# Altium project PCB_Project1.PrjPCB
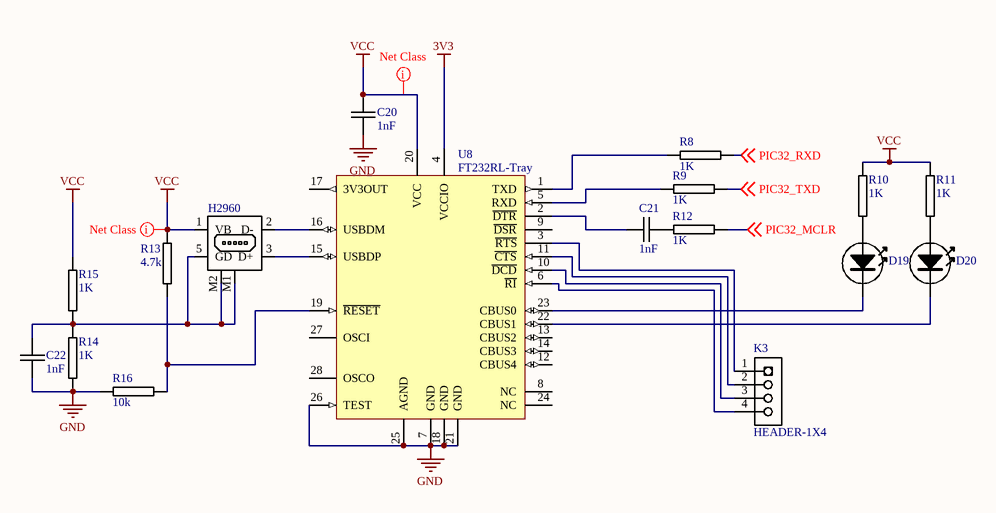
[diagram p0: USB_UART.SchDoc]
5 sheets, 78 parts. Net scope: global (net labels, ports and power ports of the same name join across sheets).
Board file: PCB1.PcbDoc
Sheets:
  USB_UART.SchDoc
  PowerSupply.SchDoc
  PIC32.SchDoc
  LED Driver.SchDoc
  CanTransceiver.SchDoc

## Sheet USB_UART.SchDoc: USB to UART interface
size A; Author: Ben Smith; CompanyName: CSUS FSAE - CPE187; DocumentName: USB to UART interface

### Parts
C20  1nF  [0603C-GENERIC]
C21  1nF  [0603C-GENERIC]
C22  1nF  [0603C-GENERIC]
D19  TOPLED-RED  [TOPLED-RED]  (value not drawn)
D20  TOPLED-RED  [TOPLED-RED]  (value not drawn)
K1  H2960  [usb-mini-b]
K3  HEADER-1X4  [HEADER-1X4]
R8  1K  [0603R-1k]
R9  1K  [0603R-1k]
R10  1K  [0603R-1k]
R11  1K  [0603R-1k]
R12  1K  [0603R-1k]
R13  4.7k  [0603R-1k]
R14  1K  [0603R-1k]
R15  1K  [0603R-1k]
R16  10k  [0603R-1k]
U8  FT232RL-Tray  [SSOP-28_N]

### Nets
3V3: U8.4(VCCIO)
GND: C20.2 C22.2 R14.2 R16.2 U8.7(GND) U8.18(GND) U8.21(GND) U8.25(AGND) U8.26(TEST)
VCC: C20.1 K1.1(VB) R10.2 R11.2 R13.1 R15.1 U8.20(VCC)
PIC32_MCLR: R12.2 ; off-sheet PIC32_MCLR
PIC32_RXD: R8.2 ; off-sheet PIC32_RXD
PIC32_TXD: R9.2 ; off-sheet PIC32_TXD
NetC21_1: C21.1 U8.2(~{DTR})
NetC22_1: C22.1 K1.5(GD) K1.M1 K1.M2 R14.1 R15.2
NetD19_A: D19.A R10.1
NetD19_K: D19.K U8.23(CBUS0)
NetD20_A: D20.A R11.1
NetD20_K: D20.K U8.22(CBUS1)
NetK1_2: K1.2(D-) U8.16(USBDM)
NetK1_3: K1.3(D+) U8.15(USBDP)
NetK3_1: K3.1 U8.3(~{RTS})
NetK3_2: K3.2 U8.11(~{CTS})
NetK3_3: K3.3 U8.10(~{DCD})
NetK3_4: K3.4 U8.6(~{RI})
NetR8_1: R8.1 U8.1(TXD)
NetR9_1: R9.1 U8.5(RXD)
NetR13_2: R13.2 R16.1 U8.19(~{RESET})

Not connected (* = marked no-connect by the designer): C21 2; R12 1; U8 8(NC) 9(~{DSR}) 12(CBUS4) 13(CBUS2) 14(CBUS3) 17(3V3OUT) 24(NC) 27(OSCI) 28(OSCO)

### Layout directives
net class Power: VCC

### Library data of the parts
C20-C22 = 0603C-000: CAPACITOR 0603 CERAMIC
D19 D20 = TOPLED-RED: Manufacturer: OSRAM Opto Semiconductors Inc; Manufacturer Part Number: LS T676-Q1R2-1-Z; Reel: D13; Supplier 1: Digi-Key; Supplier Part Number 1: 475-1133-2-ND
K1 = USB-H2960: MINI USB B DEVICE CONNECTOR
R8-R16 = 0603R-1K: GENERIC RESISTOR 0603; Manufacturer Part Number: RMCF 1/16 1K 1% R; Manufacturer: Stackpole Electronics Inc; Reel: R14; Supplier 1: Digi-Key; Supplier Part Number 1: RMCF0603FT1K00TR-ND
U8 = FT232RL-Tray: USB UART Asynchronous Serial Data Transfer Chip, SSOP-28, Tray; Published: 19-Aug-2010; DatasheetVersion: ver 2.07, Jul-2010; PackageVersion: 2010; PackageReference: SSOP-28; Publisher: Altium Limited; PackageDescription: 28-Pin Small Outline Package 0.65 mm Pitch; ComponentLink1Description: Manufacturer Link; ComponentLink1URL: http://www.ftdichip.com/Products/ICs/FT232R.htm; ComponentLink2Description: Datasheet; ComponentLink2URL: http://www.ftdichip.com/Support/Documents/DataSheets/ICs/DS_FT232R.pdf
K3 = HEADER-1X4: Supplier 1: Digi-Key; Supplier Part Number 1: S1011E-36-ND

## Sheet PowerSupply.SchDoc
size A
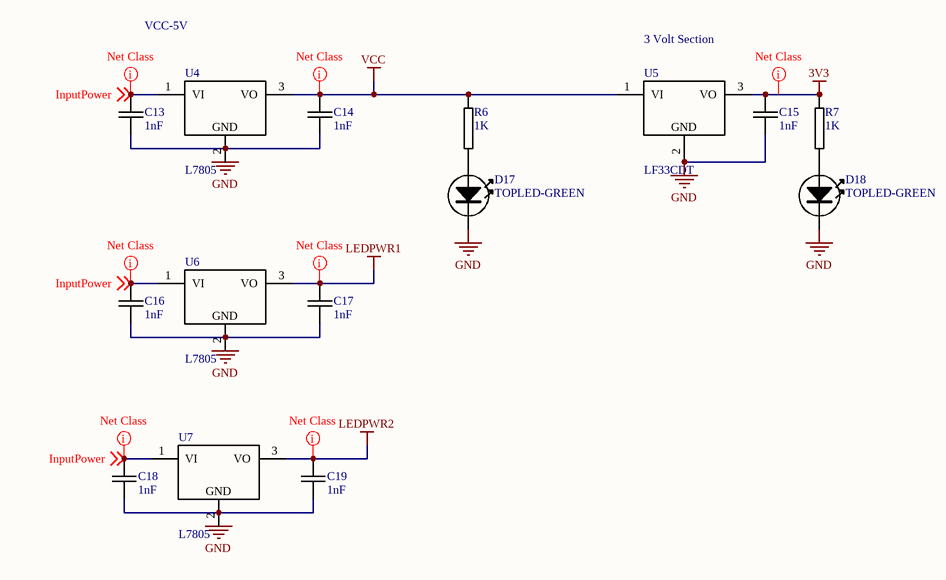
[diagram p1: PowerSupply.SchDoc]

### Parts
C13  1nF  [0603C-GENERIC]
C14  1nF  [0603C-GENERIC]
C15  1nF  [0603C-GENERIC]
C16  1nF  [0603C-GENERIC]
C17  1nF  [0603C-GENERIC]
C18  1nF  [0603C-GENERIC]
C19  1nF  [0603C-GENERIC]
D17  TOPLED-GREEN  [TOPLED-GREEN]
D18  TOPLED-GREEN  [TOPLED-GREEN]
R6  1K  [0603R-1k]
R7  1K  [0603R-1k]
U4  L7805  [DPAK]
U5  LF33CDT  [DPAK]
U6  L7805  [DPAK]
U7  L7805  [DPAK]

### Nets
3V3: C15.1 R7.1 U5.3(VO)
GND: C13.2 C14.2 C15.2 C16.2 C17.2 C18.2 C19.2 D17.K D18.K U5.2
LEDPWR1: C17.1 U6.3(VO)
LEDPWR2: C19.1 U7.3(VO)
VCC: C14.1 R6.1 U4.3(VO) U5.1(VI)
InputPower: C13.1 C16.1 C18.1 U4.1(VI) U6.1(VI) U7.1(VI) ; off-sheet InputPower
NetD17_A: D17.A R6.2
NetD18_A: D18.A R7.2

Not connected (* = marked no-connect by the designer): U4 2; U6 2; U7 2

### Layout directives
net class Power: 3V3, LEDPWR1, LEDPWR2, VCC
net class InputPower: InputPower

### Notes on the sheet
- VCC-5V
- 3 Volt Section
- (in symbol L7805-DPAK) GND
- (in symbol LF33CDT) GND

### Library data of the parts
C13-C19 = 0603C-000: CAPACITOR 0603 CERAMIC
R6 R7 = 0603R-1K: as R8 on sheet USB_UART; Supplier 1: Digi-Key; Supplier Part Number 1: RMCF0603FT1K00TR-ND
U4 U6 U7 = L7805-DPAK: LINEAR REGULATOR 5.0V; Supplier 1: Digi-Key; Supplier Part Number 1: 497-7255-6-ND
U5 = LF33CDT: Low Drop Voltage Regulator 3.3V; Text Field1: ST; Text Field3: Mouser; Text Field4: 511-LF33CDT; Text Field6: 0.57; Text Field2: LF33CDT; Text Field5: DPAK; NI?: *; O?: *; Section:: *

## Sheet PIC32.SchDoc
size A; PageSetup: Record=PageOptions|CenterHorizontal=True|CenterVertical=True|PrintScale=1.07|XCorrection=1.00|YCorrection=1.00|PrintKind=1|BorderSize=5000000|LeftOffset=0|BottomOffset=0|Orientation=2|PaperLength=1000|PaperWidth=1000|Scale=100|PaperSource=7|PrintQuality=-4|MediaType=1|DitherType=10|PaperKind=A5|PrintScaleMode=1
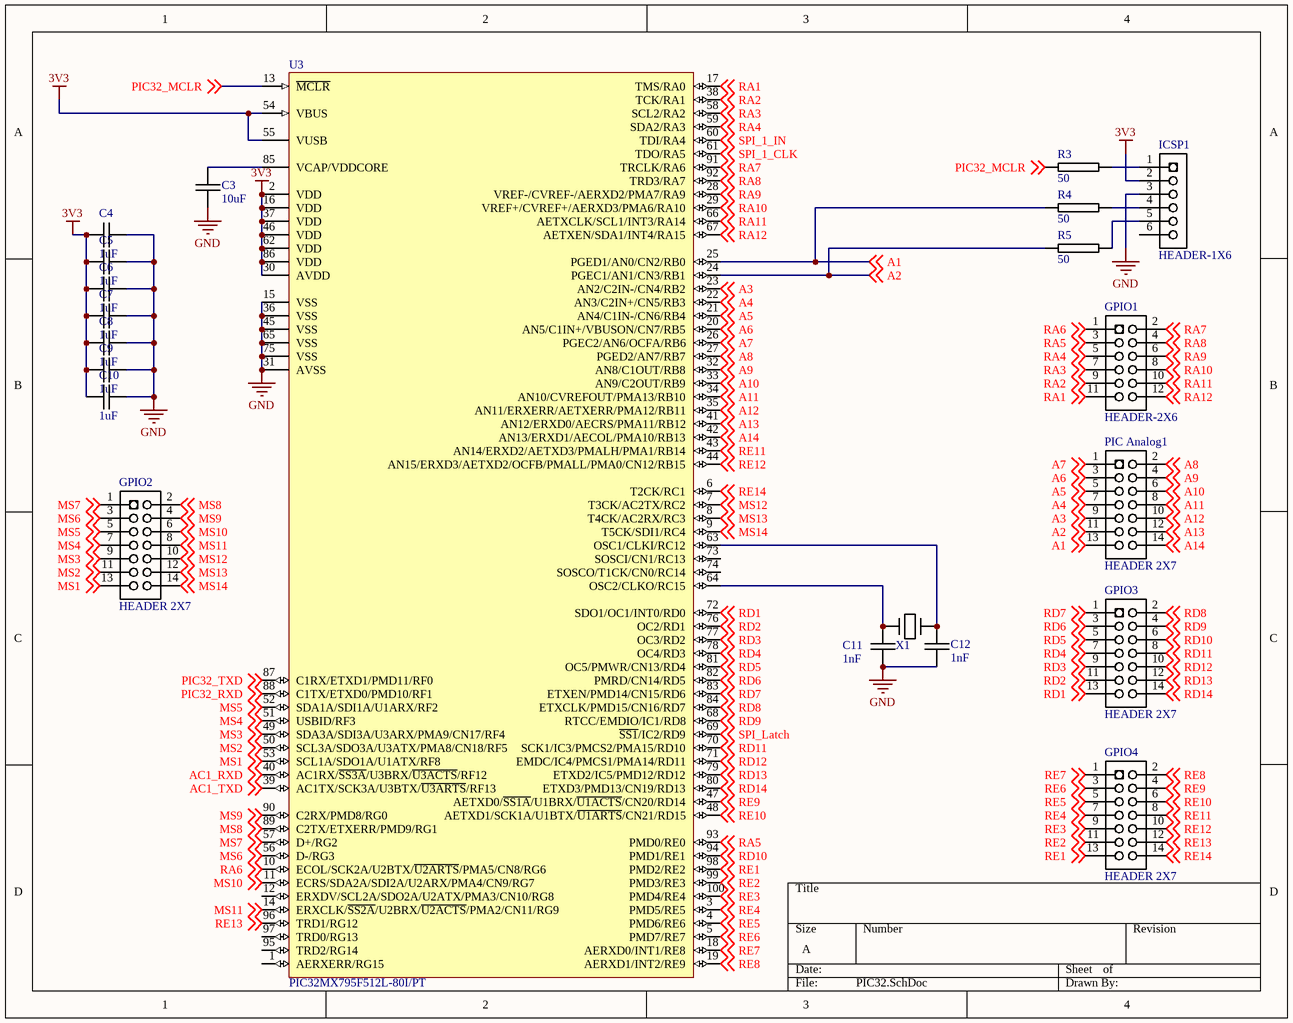
[diagram p2: PIC32.SchDoc]

### Parts
C3  10uF  [0603C-GENERIC]
C4  1uF  [0603C-GENERIC]
C5  1uF  [0603C-GENERIC]
C6  1uF  [0603C-GENERIC]
C7  1uF  [0603C-GENERIC]
C8  1uF  [0603C-GENERIC]
C9  1uF  [0603C-GENERIC]
C10  1uF  [0603C-GENERIC]
C11  1nF  [0603C-GENERIC]
C12  1nF  [0603C-GENERIC]
GPIO1  HEADER-2X6  [HEADER-2X6]
GPIO2  HEADER 2X7  [HEADER-2X7]
GPIO3  HEADER 2X7  [HEADER-2X7]
GPIO4  HEADER 2X7  [HEADER-2X7]
ICSP1  HEADER-1X6  [HEADER-1X6]
PIC_Analog1  HEADER 2X7  [HEADER-2X7]
R3  50  [0603R-TBD]
R4  50  [0603R-TBD]
R5  50  [0603R-TBD]
U3  PIC32MX795F512L-80I/PT  [TQFP-PT100_N]
X1  CRYSTAL-GENERIC  [XTAL-RU49/4]  (value not drawn)

### Nets
3V3: C4.1 C5.1 C6.1 C7.1 C8.1 C9.1 C10.1 ICSP1.2 U3.2(VDD) U3.16(VDD) U3.30(AVDD) U3.37(VDD) U3.46(VDD) U3.54(VBUS) U3.55(VUSB) U3.62(VDD) U3.86(VDD)
GND: C3.2 C4.2 C5.2 C6.2 C7.2 C8.2 C9.2 C10.2 C11.2 C12.2 ICSP1.3 U3.15(VSS) U3.31(AVSS) U3.36(VSS) U3.45(VSS) U3.65(VSS) U3.75(VSS)
A1: PIC_Analog1.13 R4.1 U3.25(PGED1/AN0/CN2/RB0) ; off-sheet A1
A2: PIC_Analog1.11 R5.2 U3.24(PGEC1/AN1/CN3/RB1) ; off-sheet A2
A3: PIC_Analog1.9 U3.23(AN2/C2IN-/CN4/RB2) ; off-sheet A3
A4: PIC_Analog1.7 U3.22(AN3/C2IN+/CN5/RB3) ; off-sheet A4
A5: PIC_Analog1.5 U3.21(AN4/C1IN-/CN6/RB4) ; off-sheet A5
A6: PIC_Analog1.3 U3.20(AN5/C1IN+/VBUSON/CN7/RB5) ; off-sheet A6
A7: PIC_Analog1.1 U3.26(PGEC2/AN6/OCFA/RB6) ; off-sheet A7
A8: PIC_Analog1.2 U3.27(PGED2/AN7/RB7) ; off-sheet A8
A9: PIC_Analog1.4 U3.32(AN8/C1OUT/RB8) ; off-sheet A9
A10: PIC_Analog1.6 U3.33(AN9/C2OUT/RB9) ; off-sheet A10
A11: PIC_Analog1.8 U3.34(AN10/CVREFOUT/PMA13/RB10) ; off-sheet A11
A12: PIC_Analog1.10 U3.35(AN11/ERXERR/AETXERR/PMA12/RB11) ; off-sheet A12
A13: PIC_Analog1.12 U3.41(AN12/ERXD0/AECRS/PMA11/RB12) ; off-sheet A13
A14: PIC_Analog1.14 U3.42(AN13/ERXD1/AECOL/PMA10/RB13) ; off-sheet A14
AC1_RXD: U3.40(AC1RX/~{SS3A}/U3BRX/~{U3ACTS}/RF12) ; off-sheet AC1_RXD
AC1_TXD: U3.39(AC1TX/SCK3A/U3BTX/~{U3ARTS}/RF13) ; off-sheet AC1_TXD
MS1: GPIO2.13 U3.53(SCL1A/SDO1A/U1ATX/RF8) ; off-sheet MS1
MS2: GPIO2.11 U3.50(SCL3A/SDO3A/U3ATX/PMA8/CN18/RF5) ; off-sheet MS2
MS3: GPIO2.9 U3.49(SDA3A/SDI3A/U3ARX/PMA9/CN17/RF4) ; off-sheet MS3
MS4: GPIO2.7 U3.51(USBID/RF3) ; off-sheet MS4
MS5: GPIO2.5 U3.52(SDA1A/SDI1A/U1ARX/RF2) ; off-sheet MS5
MS6: GPIO2.3 U3.56(D-/RG3) ; off-sheet MS6
MS7: GPIO2.1 U3.57(D+/RG2) ; off-sheet MS7
MS8: GPIO2.2 U3.89(C2TX/ETXERR/PMD9/RG1) ; off-sheet MS8
MS9: GPIO2.4 U3.90(C2RX/PMD8/RG0) ; off-sheet MS9
MS10: GPIO2.6 U3.11(ECRS/SDA2A/SDI2A/U2ARX/PMA4/CN9/RG7) ; off-sheet MS10
MS11: GPIO2.8 U3.14(ERXCLK/~{SS2A}/U2BRX/~{U2ACTS}/PMA2/CN11/RG9) ; off-sheet MS11
MS12: GPIO2.10 U3.7(T3CK/AC2TX/RC2) ; off-sheet MS12
MS13: GPIO2.12 U3.8(T4CK/AC2RX/RC3) ; off-sheet MS13
MS14: GPIO2.14 U3.9(T5CK/SDI1/RC4) ; off-sheet MS14
PIC32_MCLR: R3.2 U3.13(~{MCLR}) ; off-sheet PIC32_MCLR
PIC32_RXD: U3.88(C1TX/ETXD0/PMD10/RF1) ; off-sheet PIC32_RXD
PIC32_TXD: U3.87(C1RX/ETXD1/PMD11/RF0) ; off-sheet PIC32_TXD
RA1: GPIO1.11 U3.17(TMS/RA0) ; off-sheet RA1
RA2: GPIO1.9 U3.38(TCK/RA1) ; off-sheet RA2
RA3: GPIO1.7 U3.58(SCL2/RA2) ; off-sheet RA3
RA4: GPIO1.5 U3.59(SDA2/RA3) ; off-sheet RA4
RA5: GPIO1.3 U3.93(PMD0/RE0) ; off-sheet RA5
RA6: GPIO1.1 U3.10(ECOL/SCK2A/U2BTX/~{U2ARTS}/PMA5/CN8/RG6) ; off-sheet RA6
RA7: GPIO1.2 U3.91(TRCLK/RA6) ; off-sheet RA7
RA8: GPIO1.4 U3.92(TRD3/RA7) ; off-sheet RA8
RA9: GPIO1.6 U3.28(VREF-/CVREF-/AERXD2/PMA7/RA9) ; off-sheet RA9
RA10: GPIO1.8 U3.29(VREF+/CVREF+/AERXD3/PMA6/RA10) ; off-sheet RA10
RA11: GPIO1.10 U3.66(AETXCLK/SCL1/INT3/RA14) ; off-sheet RA11
RA12: GPIO1.12 U3.67(AETXEN/SDA1/INT4/RA15) ; off-sheet RA12
RD1: GPIO3.13 U3.72(SDO1/OC1/INT0/RD0) ; off-sheet RD1
RD2: GPIO3.11 U3.76(OC2/RD1) ; off-sheet RD2
RD3: GPIO3.9 U3.77(OC3/RD2) ; off-sheet RD3
RD4: GPIO3.7 U3.78(OC4/RD3) ; off-sheet RD4
RD5: GPIO3.5 U3.81(OC5/PMWR/CN13/RD4) ; off-sheet RD5
RD6: GPIO3.3 U3.82(PMRD/CN14/RD5) ; off-sheet RD6
RD7: GPIO3.1 U3.83(ETXEN/PMD14/CN15/RD6) ; off-sheet RD7
RD8: GPIO3.2 U3.84(ETXCLK/PMD15/CN16/RD7) ; off-sheet RD8
RD9: GPIO3.4 U3.68(RTCC/EMDIO/IC1/RD8) ; off-sheet RD9
RD10: GPIO3.6 U3.94(PMD1/RE1) ; off-sheet RD10
RD11: GPIO3.8 U3.70(SCK1/IC3/PMCS2/PMA15/RD10) ; off-sheet RD11
RD12: GPIO3.10 U3.71(EMDC/IC4/PMCS1/PMA14/RD11) ; off-sheet RD12
RD13: GPIO3.12 U3.79(ETXD2/IC5/PMD12/RD12) ; off-sheet RD13
RD14: GPIO3.14 U3.80(ETXD3/PMD13/CN19/RD13) ; off-sheet RD14
RE1: GPIO4.13 U3.98(PMD2/RE2) ; off-sheet RE1
RE2: GPIO4.11 U3.99(PMD3/RE3) ; off-sheet RE2
RE3: GPIO4.9 U3.100(PMD4/RE4) ; off-sheet RE3
RE4: GPIO4.7 U3.3(PMD5/RE5) ; off-sheet RE4
RE5: GPIO4.5 U3.4(PMD6/RE6) ; off-sheet RE5
RE6: GPIO4.3 U3.5(PMD7/RE7) ; off-sheet RE6
RE7: GPIO4.1 U3.18(AERXD0/INT1/RE8) ; off-sheet RE7
RE8: GPIO4.2 U3.19(AERXD1/INT2/RE9) ; off-sheet RE8
RE9: GPIO4.4 U3.47(AETXD0/~{SS1A}/U1BRX/~{U1ACTS}/CN20/RD14) ; off-sheet RE9
RE10: GPIO4.6 U3.48(AETXD1/SCK1A/U1BTX/~{U1ARTS}/CN21/RD15) ; off-sheet RE10
RE11: GPIO4.8 U3.43(AN14/ERXD2/AETXD3/PMALH/PMA1/RB14) ; off-sheet RE11
RE12: GPIO4.10 U3.44(AN15/ERXD3/AETXD2/OCFB/PMALL/PMA0/CN12/RB15) ; off-sheet RE12
RE13: GPIO4.12 U3.96(TRD1/RG12) ; off-sheet RE13
RE14: GPIO4.14 U3.6(T2CK/RC1) ; off-sheet RE14
SPI_1_CLK: U3.61(TDO/RA5) ; off-sheet SPI_1_CLK
SPI_1_IN: U3.60(TDI/RA4) ; off-sheet SPI_1_IN
SPI_Latch: U3.69(~{SS1}/IC2/RD9) ; off-sheet SPI_Latch
NetC3_1: C3.1 U3.85(VCAP/VDDCORE)
NetC11_1: C11.1 U3.64(OSC2/CLKO/RC15) X1.1
NetC12_1: C12.1 U3.63(OSC1/CLKI/RC12) X1.2
NetICSP1_1: ICSP1.1 R3.1
NetICSP1_4: ICSP1.4 R4.2
NetICSP1_5: ICSP1.5 R5.1

Not connected (* = marked no-connect by the designer): ICSP1 6; U3 1(AERXERR/RG15) 12(ERXDV/SCL2A/SDO2A/U2ATX/PMA3/CN10/RG8) 73(SOSCI/CN1/RC13) 74(SOSCO/T1CK/CN0/RC14) 95(TRD2/RG14) 97(TRD0/RG13)

### Library data of the parts
C3-C10 = 0603C-1UF-35V-X5R-TAY: CAPACITOR 0603 CERAMIC; Manufacturer Part Number: GMK107BJ105KA-T; Manufacturer: Taiyo Yuden; Reel: C92; Supplier 1: Digi-Key; Supplier Part Number 1: 587-1437-2-ND
C11 C12 = 0603C-000: CAPACITOR 0603 CERAMIC
GPIO2-GPIO4 PIC_Analog1 = HEADER-2X7
R3-R5 = 0603R-TBD: RESISTOR 0603 VALUE TO BE DETERMINED
U3 = PIC32MX795F512L-80I/PT: High Performance 80 MHz MIPS-Based 32-Bit Flash Microcontroller with USB, CAN and Ethernet, 512KB Program Memory, 100-pin TQFP, Industrial Temperature; Published: 2-Dec-2009; DatasheetVersion: revB, Nov-2009; PackageVersion: revBB, Aug-2009; PackageReference: TQFP-PT100; Publisher: Altium Limited; PackageDescription: 100-Lead Plastic Thin Quad Flatpack (PT) - 12x12x1mm Body, 2.00mm [TQFP]; Supplier 1: Digi-Key; Supplier Part Number 1: PIC32MX795F512L-80I/PT-ND; Supplier 2: Farnell; Supplier Part Number 2: 1778492; ComponentLink1Description: Datasheet; ComponentLink1URL: http://ww1.microchip.com/downloads/en/DeviceDoc/DS-61156B.pdf; ComponentLink2Description: Packaging Specification; ComponentLink2URL: http://ww1.microchip.com/downloads/en/PackagingSpec/en012702.pdf; ComponentLink3Description: Microchip.com Home; ComponentLink3URL: http://www.microchip.com/
X1 = CRYSTAL-GENERIC: GENERIC CRYSTAL
ICSP1 = HEADER-1X6: Supplier 1: Digi-Key; Supplier Part Number 1: S1011E-36-ND

## Sheet LED Driver.SchDoc
size A
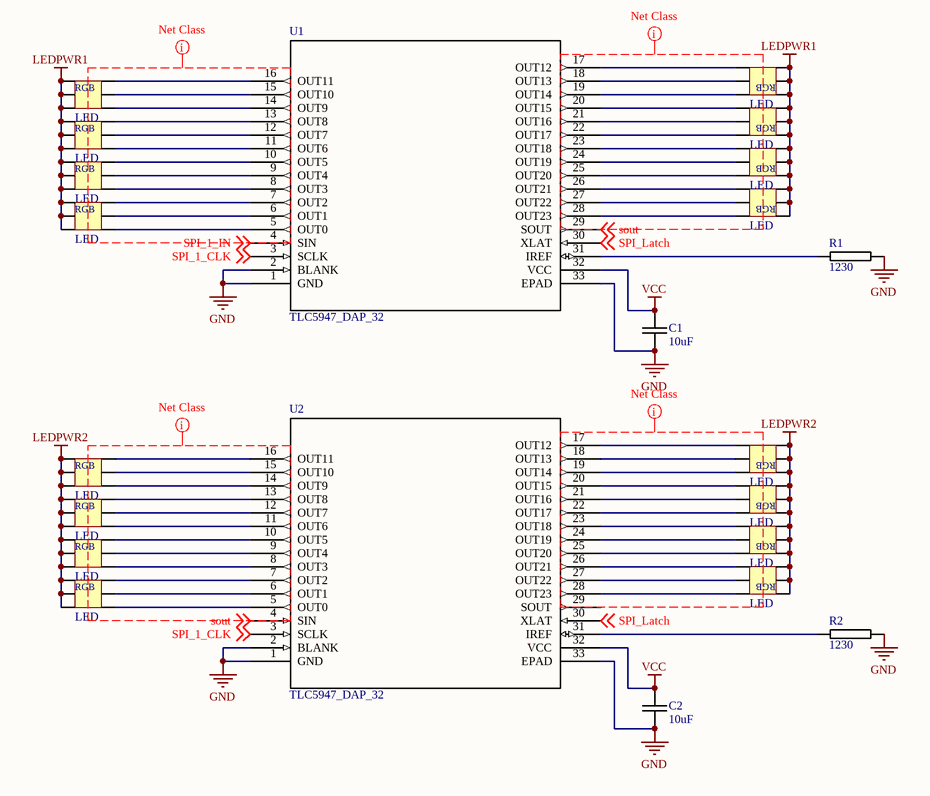
[diagram p3: LED Driver.SchDoc]

### Parts
C1  10uF  [0603C-GENERIC]
C2  10uF  [0603C-GENERIC]
D1  LED  [LED-TRICOLOR-5050]
D2  LED  [LED-TRICOLOR-5050]
D3  LED  [LED-TRICOLOR-5050]
D4  LED  [LED-TRICOLOR-5050]
D5  LED  [LED-TRICOLOR-5050]
D6  LED  [LED-TRICOLOR-5050]
D7  LED  [LED-TRICOLOR-5050]
D8  LED  [LED-TRICOLOR-5050]
D9  LED  [LED-TRICOLOR-5050]
D10  LED  [LED-TRICOLOR-5050]
D11  LED  [LED-TRICOLOR-5050]
D12  LED  [LED-TRICOLOR-5050]
D13  LED  [LED-TRICOLOR-5050]
D14  LED  [LED-TRICOLOR-5050]
D15  LED  [LED-TRICOLOR-5050]
D16  LED  [LED-TRICOLOR-5050]
R1  1230  [0603R-TBD]
R2  1230  [0603R-TBD]
U1  TLC5947_DAP_32  [DAP32_4P36X4P11]
U2  TLC5947_DAP_32  [DAP32_4P36X4P11]

### Nets
GND: C1.2 C2.2 R1.2 R2.2 U1.1(GND) U1.2(BLANK) U1.33(EPAD) U2.1(GND) U2.2(BLANK) U2.33(EPAD)
LEDPWR1: D1.1(CB) D1.2(CR) D1.3(CG) D2.1(CB) D2.2(CR) D2.3(CG) D3.1(CB) D3.2(CR) D3.3(CG) D4.1(CB) D4.2(CR) D4.3(CG) D5.1(CB) D5.2(CR) D5.3(CG) D6.1(CB) D6.2(CR) D6.3(CG) D7.1(CB) D7.2(CR) D7.3(CG) D8.1(CB) D8.2(CR) D8.3(CG)
LEDPWR2: D9.1(CB) D9.2(CR) D9.3(CG) D10.1(CB) D10.2(CR) D10.3(CG) D11.1(CB) D11.2(CR) D11.3(CG) D12.1(CB) D12.2(CR) D12.3(CG) D13.1(CB) D13.2(CR) D13.3(CG) D14.1(CB) D14.2(CR) D14.3(CG) D15.1(CB) D15.2(CR) D15.3(CG) D16.1(CB) D16.2(CR) D16.3(CG)
VCC: C1.1 C2.1 U1.32(VCC) U2.32(VCC)
sout: U1.29(SOUT) U2.4(SIN) ; off-sheet sout
SPI_1_CLK: U1.3(SCLK) U2.3(SCLK) ; off-sheet SPI_1_CLK
SPI_1_IN: U1.4(SIN) ; off-sheet SPI_1_IN
SPI_Latch: U1.30(XLAT) U2.30(XLAT) ; off-sheet SPI_Latch
NetD1_4: D1.4(AB) U1.19(OUT14)
NetD1_5: D1.5(AR) U1.18(OUT13)
NetD1_6: D1.6(AG) U1.17(OUT12)
NetD2_4: D2.4(AB) U1.16(OUT11)
NetD2_5: D2.5(AR) U1.15(OUT10)
NetD2_6: D2.6(AG) U1.14(OUT9)
NetD3_4: D3.4(AB) U1.22(OUT17)
NetD3_5: D3.5(AR) U1.21(OUT16)
NetD3_6: D3.6(AG) U1.20(OUT15)
NetD4_4: D4.4(AB) U1.13(OUT8)
NetD4_5: D4.5(AR) U1.12(OUT7)
NetD4_6: D4.6(AG) U1.11(OUT6)
NetD5_4: D5.4(AB) U1.25(OUT20)
NetD5_5: D5.5(AR) U1.24(OUT19)
NetD5_6: D5.6(AG) U1.23(OUT18)
NetD6_4: D6.4(AB) U1.10(OUT5)
NetD6_5: D6.5(AR) U1.9(OUT4)
NetD6_6: D6.6(AG) U1.8(OUT3)
NetD7_4: D7.4(AB) U1.28(OUT23)
NetD7_5: D7.5(AR) U1.27(OUT22)
NetD7_6: D7.6(AG) U1.26(OUT21)
NetD8_4: D8.4(AB) U1.7(OUT2)
NetD8_5: D8.5(AR) U1.6(OUT1)
NetD8_6: D8.6(AG) U1.5(OUT0)
NetD9_4: D9.4(AB) U2.19(OUT14)
NetD9_5: D9.5(AR) U2.18(OUT13)
NetD9_6: D9.6(AG) U2.17(OUT12)
NetD10_4: D10.4(AB) U2.16(OUT11)
NetD10_5: D10.5(AR) U2.15(OUT10)
NetD10_6: D10.6(AG) U2.14(OUT9)
NetD11_4: D11.4(AB) U2.22(OUT17)
NetD11_5: D11.5(AR) U2.21(OUT16)
NetD11_6: D11.6(AG) U2.20(OUT15)
NetD12_4: D12.4(AB) U2.13(OUT8)
NetD12_5: D12.5(AR) U2.12(OUT7)
NetD12_6: D12.6(AG) U2.11(OUT6)
NetD13_4: D13.4(AB) U2.25(OUT20)
NetD13_5: D13.5(AR) U2.24(OUT19)
NetD13_6: D13.6(AG) U2.23(OUT18)
NetD14_4: D14.4(AB) U2.10(OUT5)
NetD14_5: D14.5(AR) U2.9(OUT4)
NetD14_6: D14.6(AG) U2.8(OUT3)
NetD15_4: D15.4(AB) U2.28(OUT23)
NetD15_5: D15.5(AR) U2.27(OUT22)
NetD15_6: D15.6(AG) U2.26(OUT21)
NetD16_4: D16.4(AB) U2.7(OUT2)
NetD16_5: D16.5(AR) U2.6(OUT1)
NetD16_6: D16.6(AG) U2.5(OUT0)
NetR1_1: R1.1 U1.31(IREF)
NetR2_1: R2.1 U2.31(IREF)

Not connected (* = marked no-connect by the designer): U2 29(SOUT)

### Layout directives
net class LEDGnd: (no net found under the mark), sout, SPI_1_IN

### Notes on the sheet
- (in symbol RGB LED) RGB

### Library data of the parts
C1 C2 = 0603C-10UF-10V-X5R-TDK: CAPACITOR 0603 CERAMIC; Manufacturer Part Number: C1608X5R0J106M; Manufacturer: TDK Corporation; Reel: C31; Supplier 1: Digi-Key; Supplier Part Number 1: 445-4112-2-ND
D1-D16 = RGB LED
R1 R2 = 0603R-TBD: RESISTOR 0603 VALUE TO BE DETERMINED
U1 U2 = TLC5947_DAP_32: Imported; Vendor: Texas Instruments; PACKAGE_DESIGNATOR: DAP; PIN_COUNT: 32; FAMILY_NAME: LED DRIVER; INDUSTRY_STD_PKG_TYPE: HTSSOP; Manufacturer_Part_Number: tlc5947_dap_32; GENERIC_PART_NUMBER: TLC5947; Datasheet URL: http://www.ti.com/lit/gpn/TLC5947; Manufacturer: Texas Instruments; RefDes: RefDes; Type: DEV; Value: Value

## Sheet CanTransceiver.SchDoc
size A
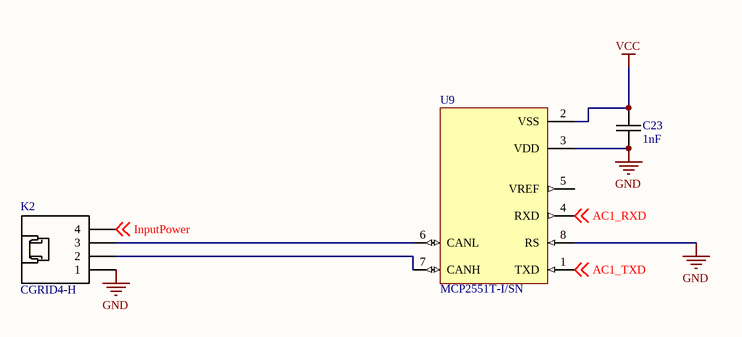
[diagram p4: CanTransceiver.SchDoc]

### Parts
C23  1nF  [0603C-GENERIC]
K2  CGRID4-H  [CGRID-4H]
U9  MCP2551T-I/SN  [SOIC-SN8_N]

### Nets
GND: C23.2 K2.1 U9.3(VDD) U9.8(RS)
VCC: C23.1 U9.2(VSS)
AC1_RXD: U9.4(RXD) ; off-sheet AC1_RXD
AC1_TXD: U9.1(TXD) ; off-sheet AC1_TXD
InputPower: K2.4 ; off-sheet InputPower
NetK2_2: K2.2 U9.7(CANH)
NetK2_3: K2.3 U9.6(CANL)

Not connected (* = marked no-connect by the designer): U9 5(VREF)

### Library data of the parts
C23 = 0603C-000: CAPACITOR 0603 CERAMIC
K2 = CGRID4-H: MOLEX GC/WALDOM CGRID CONNECTOR 4 PIN; Supplier 1: Digi-Key; Supplier Part Number 1: WM4902-ND
U9 = MCP2551T-I/SN: High-Speed CAN Transceiver, 8-Pin SOIC, Industrial Temperature, Tape and Reel; Published: 29-Jan-2009; DatasheetVersion: revE, Jan-2007; PackageVersion: revBB, Aug-2009; PackageReference: SOIC-SN8; Publisher: Altium Limited; PackageDescription: 8-Lead Plastic Small Outline (SN) - Narrow, 3.90mm Body [SOIC]; Supplier 1: Digi-Key; Supplier Part Number 1: MCP2551T-I/SNTR-ND; Supplier 2: Farnell; Supplier Part Number 2: 1788569; Code_JEDEC: MS-012; Code_IPC: SOIC127P600-8; ComponentLink1Description: Datasheet; ComponentLink1URL: http://ww1.microchip.com/downloads/en/DeviceDoc/21667E.pdf; ComponentLink2Description: Packaging Specification; ComponentLink2URL: http://www.microchip.com/stellent/groups/techpub_sg/documents/packagingspec/en012702.pdf; ComponentLink3Description: Microchip.com Home; ComponentLink3URL: http://www.microchip.com/

## Nets that join several sheets
3V3: USB_UART (U8.4), PowerSupply (C15.1 R7.1 U5.3), PIC32 (17 pins)
GND: USB_UART (9 pins), PowerSupply (10 pins), PIC32 (17 pins), LED Driver (10 pins), CanTransceiver (C23.2 K2.1 U9.3 U9.8)
LEDPWR1: PowerSupply (C17.1 U6.3), LED Driver (24 pins)
LEDPWR2: PowerSupply (C19.1 U7.3), LED Driver (24 pins)
VCC: USB_UART (7 pins), PowerSupply (C14.1 R6.1 U4.3 U5.1), LED Driver (C1.1 C2.1 U1.32 U2.32), CanTransceiver (C23.1 U9.2)
AC1_RXD: PIC32 (U3.40), CanTransceiver (U9.4)
AC1_TXD: PIC32 (U3.39), CanTransceiver (U9.1)
InputPower: PowerSupply (6 pins), CanTransceiver (K2.4)
PIC32_MCLR: USB_UART (R12.2), PIC32 (R3.2 U3.13)
PIC32_RXD: USB_UART (R8.2), PIC32 (U3.88)
PIC32_TXD: USB_UART (R9.2), PIC32 (U3.87)
SPI_1_CLK: PIC32 (U3.61), LED Driver (U1.3 U2.3)
SPI_1_IN: PIC32 (U3.60), LED Driver (U1.4)
SPI_Latch: PIC32 (U3.69), LED Driver (U1.30 U2.30)